# EAGLE schematic MultiEffect (EAGLE 9.6.2)

## Sheet 1 of 2: Audio & Power
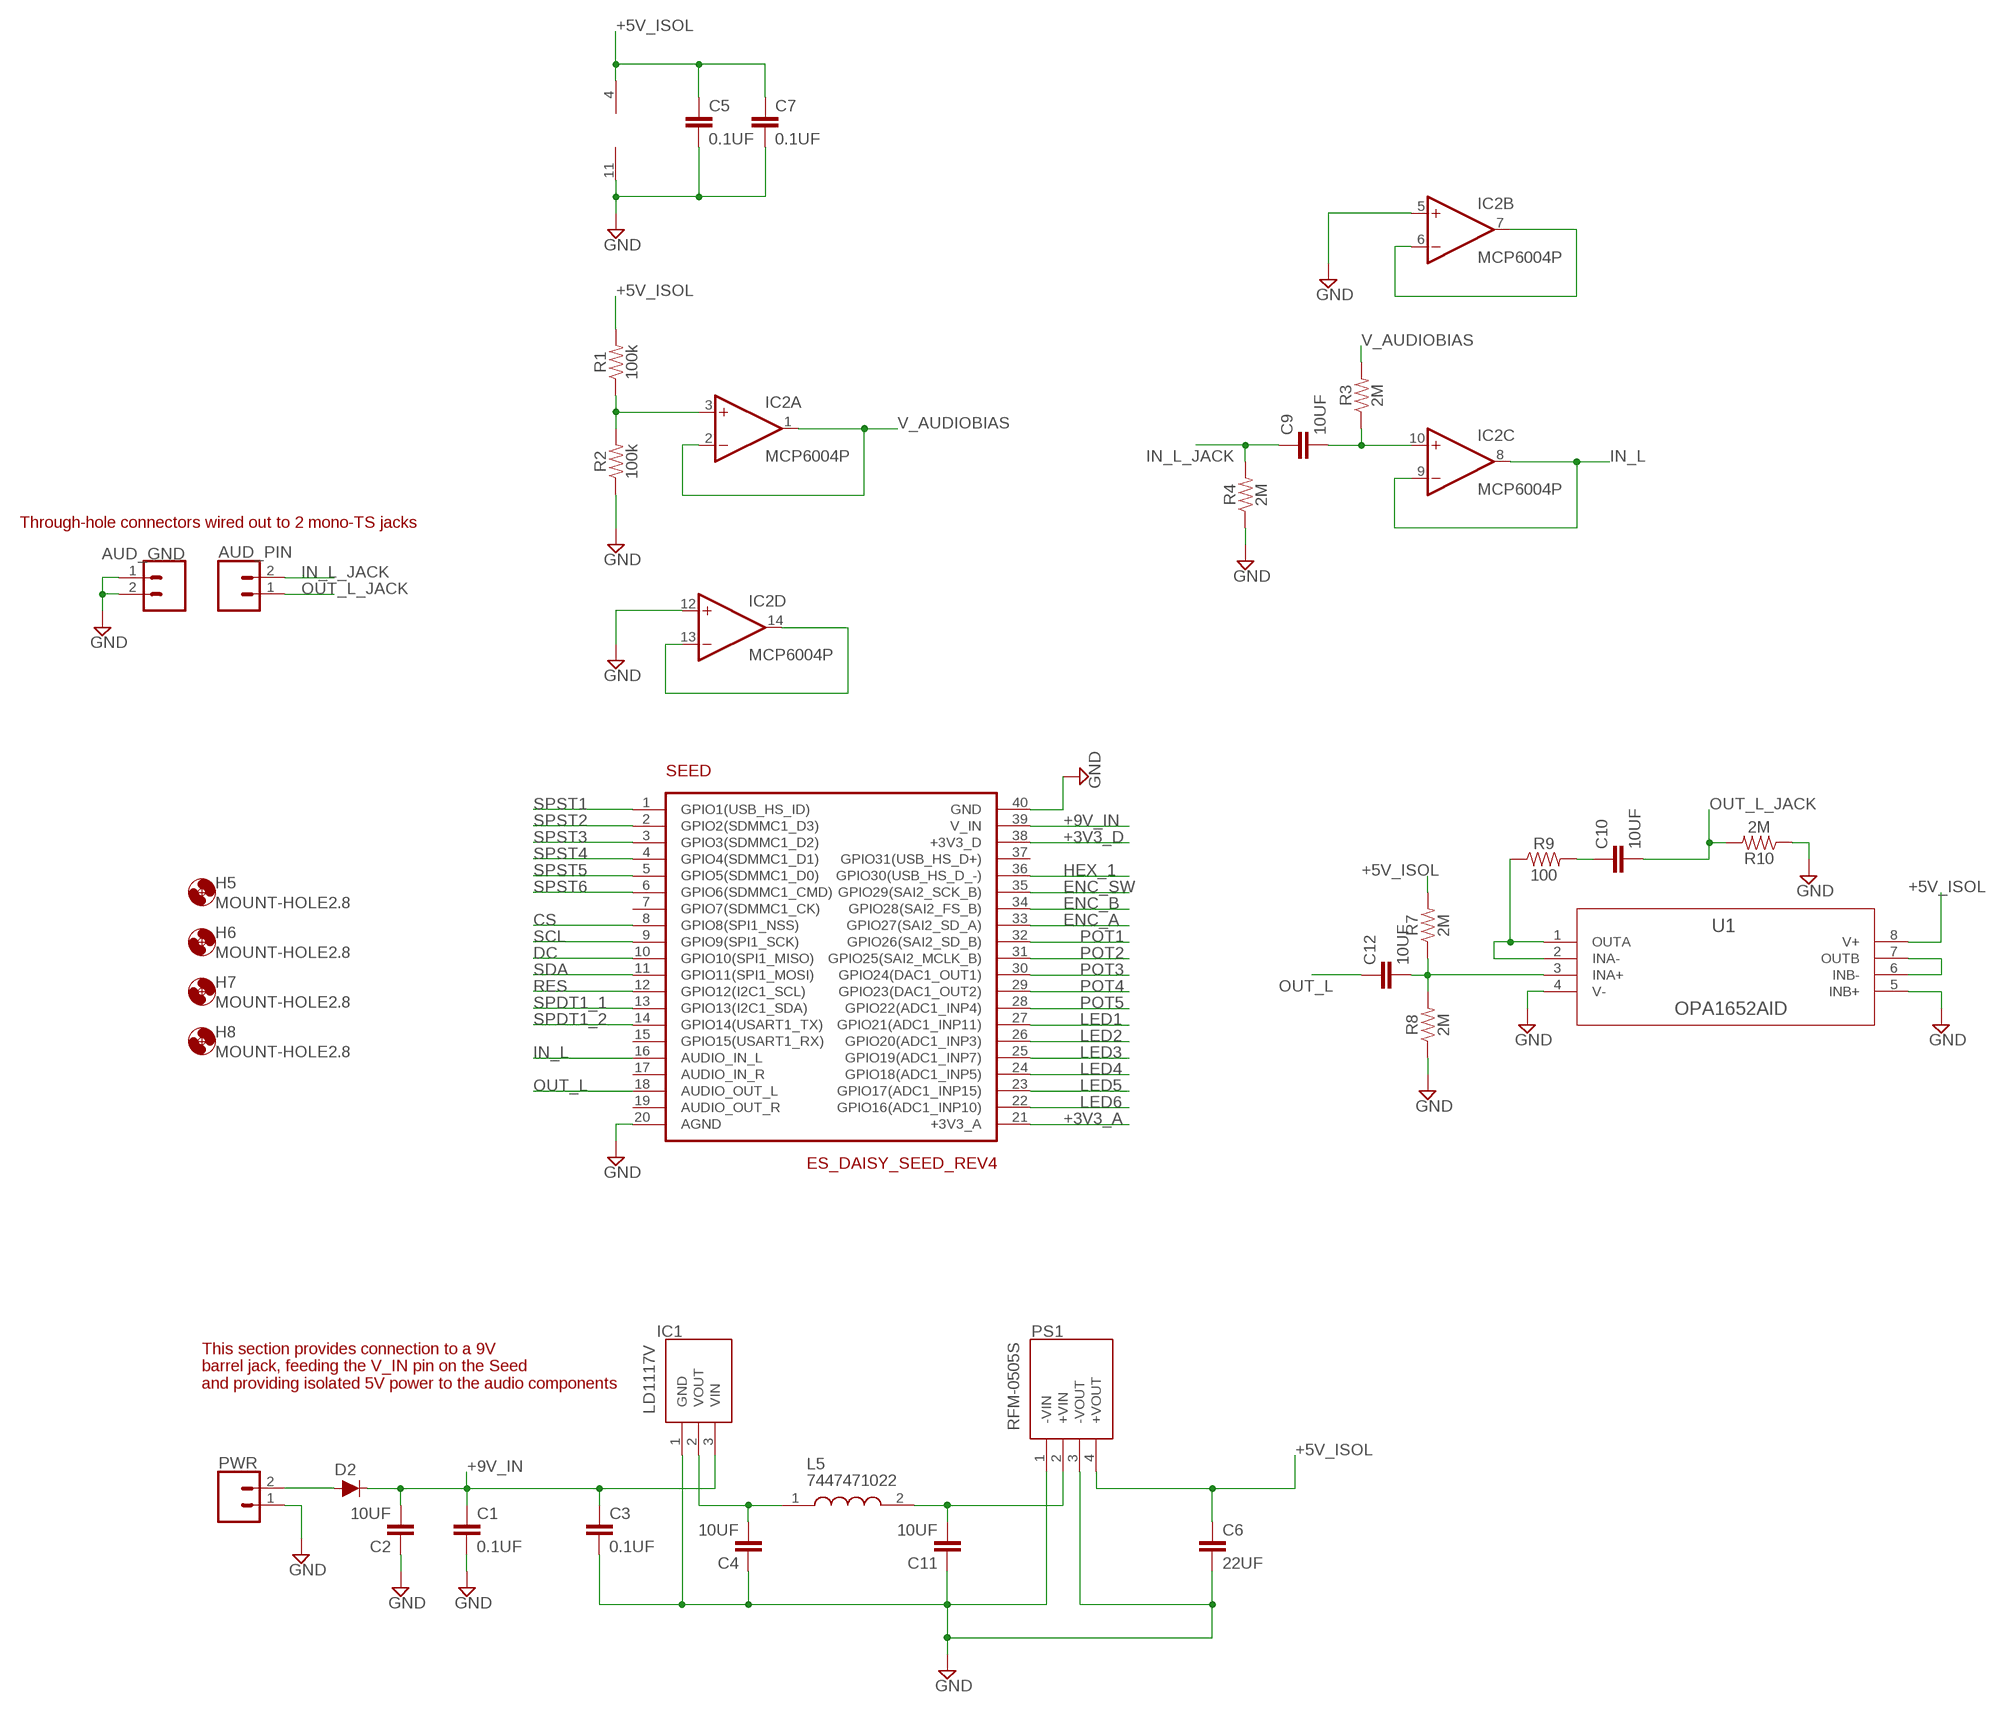
[diagram p0: schematic, sheet 1]

### Parts
AUD_GND  CONN_02  [1X02]
AUD_PIN  CONN_02  [1X02]
C1  0.1UF  [CAP-PTH-SMALL-KIT]
C2  10UF  [CAP-PTH-SMALL-KIT]
C3  0.1UF  [CAP-PTH-SMALL-KIT]
C4  10UF  [CAP-PTH-SMALL-KIT]
C5  0.1UF  [CAP-PTH-SMALL-KIT]
C6  22UF  [CAP-PTH-SMALL-KIT]
C7  0.1UF  [CAP-PTH-SMALL-KIT]
C9  10UF  [CAP-PTH-SMALL-KIT]
C10  10UF  [CAP-PTH-SMALL-KIT]
C11  10UF  [CAP-PTH-SMALL-KIT]
C12  10UF  [CAP-PTH-SMALL-KIT]
D2  200mA/100V/1V  DIODE-1N4148  [DIODE-1N4148]
H5  MOUNT-HOLE2.8  [2,8]
H6  MOUNT-HOLE2.8  [2,8]
H7  MOUNT-HOLE2.8  [2,8]
H8  MOUNT-HOLE2.8  [2,8]
IC1  LD1117V  [TO255P460X1020X2008-3P]
IC2  MCP6004P  [DIL14]
L5  7447471022  [WE-TIS_111190]
PS1  RFM-0505S  [RFM0505S]
PWR  CONN_02  [1X02]
R1  100k  100KOHM-HORIZ-1/4W-5%  [AXIAL-0.3]
R2  100k  100KOHM-HORIZ-1/4W-5%  [AXIAL-0.3]
R3  2M  2MOHM-HORIZ-1/4W-5%  [AXIAL-0.3]
R4  2M  2MOHM-HORIZ-1/4W-5%  [AXIAL-0.3]
R7  2M  2MOHM-HORIZ-1/4W-5%  [AXIAL-0.3]
R8  2M  2MOHM-HORIZ-1/4W-5%  [AXIAL-0.3]
R9  100  100OHM-HORIZ-1/4W-1%  [AXIAL-0.3]
R10  2M  2MOHM-HORIZ-1/4W-5%  [AXIAL-0.3]
SEED  ES_DAISY_SEED_REV4  [ES_DAISY_SEED]
U1  OPA1652AID  [D8]

### Nets
+3V3_A: SEED.21(+3V3_A) ; also sheet 2
+3V3_D: SEED.38(+3V3_D) ; also sheet 2
+5V_ISOL: C5.1 C6.1 C7.1 IC2.4(P:V+) PS1.4(+VOUT) R1.P$2 R7.P$2 U1.8(V+)
+9V_IN: C1.1 C2.2 C3.1 D2.C IC1.3(VIN) SEED.39(V_IN)
CS: SEED.8(GPIO8(SPI1_NSS)) ; also sheet 2
DC: SEED.10(GPIO10(SPI1_MISO)) ; also sheet 2
ENC_A: SEED.33(GPIO27(SAI2_SD_A)) ; also sheet 2
ENC_B: SEED.34(GPIO28(SAI2_FS_B)) ; also sheet 2
ENC_SW: SEED.35(GPIO29(SAI2_SCK_B)) ; also sheet 2
GND: AUD_GND.1 AUD_GND.2 C1.2 C2.1 C3.2 C4.1 C5.2 C6.2 C7.2 C11.1 IC1.1(GND) IC2.5(B:+IN) IC2.11(P:V-) IC2.12(D:+IN) PS1.1(-VIN) PS1.3(-VOUT) PWR.1 R2.P$1 R4.P$1 R8.P$1 R10.P$1 SEED.20(AGND) SEED.40(GND) U1.4(V-) U1.5(INB+) ; also sheet 2
HEX_1: SEED.36(GPIO30(USB_HS_D_-))
IN_L: IC2.8(C:OUT) IC2.9(C:-IN) SEED.16(AUDIO_IN_L)
IN_L_JACK: AUD_PIN.2 C9.1 R4.P$2
LED1: SEED.27(GPIO21(ADC1_INP11)) ; also sheet 2
LED2: SEED.26(GPIO20(ADC1_INP3)) ; also sheet 2
LED3: SEED.25(GPIO19(ADC1_INP7)) ; also sheet 2
LED4: SEED.24(GPIO18(ADC1_INP5)) ; also sheet 2
LED5: SEED.23(GPIO17(ADC1_INP15)) ; also sheet 2
LED6: SEED.22(GPIO16(ADC1_INP10)) ; also sheet 2
N$2: D2.A PWR.2
N$6: IC2.3(A:+IN) R1.P$1 R2.P$2
N$7: C11.2 L5.2 PS1.2(+VIN)
N$8: C4.2 IC1.2(VOUT) L5.1
N$9: C9.2 IC2.10(C:+IN) R3.P$1
N$10: IC2.13(D:-IN) IC2.14(D:OUT)
N$12: C12.2 R7.P$1 R8.P$2 U1.3(INA+)
N$13: R9.P$1 U1.1(OUTA) U1.2(INA-)
N$14: C10.1 R9.P$2
N$15: U1.6(INB-) U1.7(OUTB)
N$18: IC2.6(B:-IN) IC2.7(B:OUT)
OUT_L: C12.1 SEED.18(AUDIO_OUT_L)
OUT_L_JACK: AUD_PIN.1 C10.2 R10.P$2
POT1: SEED.32(GPIO26(SAI2_SD_B)) ; also sheet 2
POT2: SEED.31(GPIO25(SAI2_MCLK_B)) ; also sheet 2
POT3: SEED.30(GPIO24(DAC1_OUT1)) ; also sheet 2
POT4: SEED.29(GPIO23(DAC1_OUT2)) ; also sheet 2
POT5: SEED.28(GPIO22(ADC1_INP4)) ; also sheet 2
RES: SEED.12(GPIO12(I2C1_SCL)) ; also sheet 2
SCL: SEED.9(GPIO9(SPI1_SCK)) ; also sheet 2
SDA: SEED.11(GPIO11(SPI1_MOSI)) ; also sheet 2
SPDT1_1: SEED.13(GPIO13(I2C1_SDA)) ; also sheet 2
SPDT1_2: SEED.14(GPIO14(USART1_TX)) ; also sheet 2
SPST1: SEED.1(GPIO1(USB_HS_ID)) ; also sheet 2
SPST2: SEED.2(GPIO2(SDMMC1_D3)) ; also sheet 2
SPST3: SEED.3(GPIO3(SDMMC1_D2)) ; also sheet 2
SPST4: SEED.4(GPIO4(SDMMC1_D1)) ; also sheet 2
SPST5: SEED.5(GPIO5(SDMMC1_D0)) ; also sheet 2
SPST6: SEED.6(GPIO6(SDMMC1_CMD)) ; also sheet 2
V_AUDIOBIAS: IC2.1(A:OUT) IC2.2(A:-IN) R3.P$2
Unconnected: SEED.7(GPIO7(SDMMC1_CK)) SEED.15(GPIO15(USART1_RX)) SEED.17(AUDIO_IN_R) SEED.19(AUDIO_OUT_R) SEED.37(GPIO31(USB_HS_D+))

### Notes on the sheet
- Through-hole connectors wired out to 2 mono-TS jacks
- This section provides connection to a 9V
  barrel jack, feeding the V_IN pin on the Seed 
  and providing isolated 5V power to the audio components

## Sheet 2 of 2: I/O
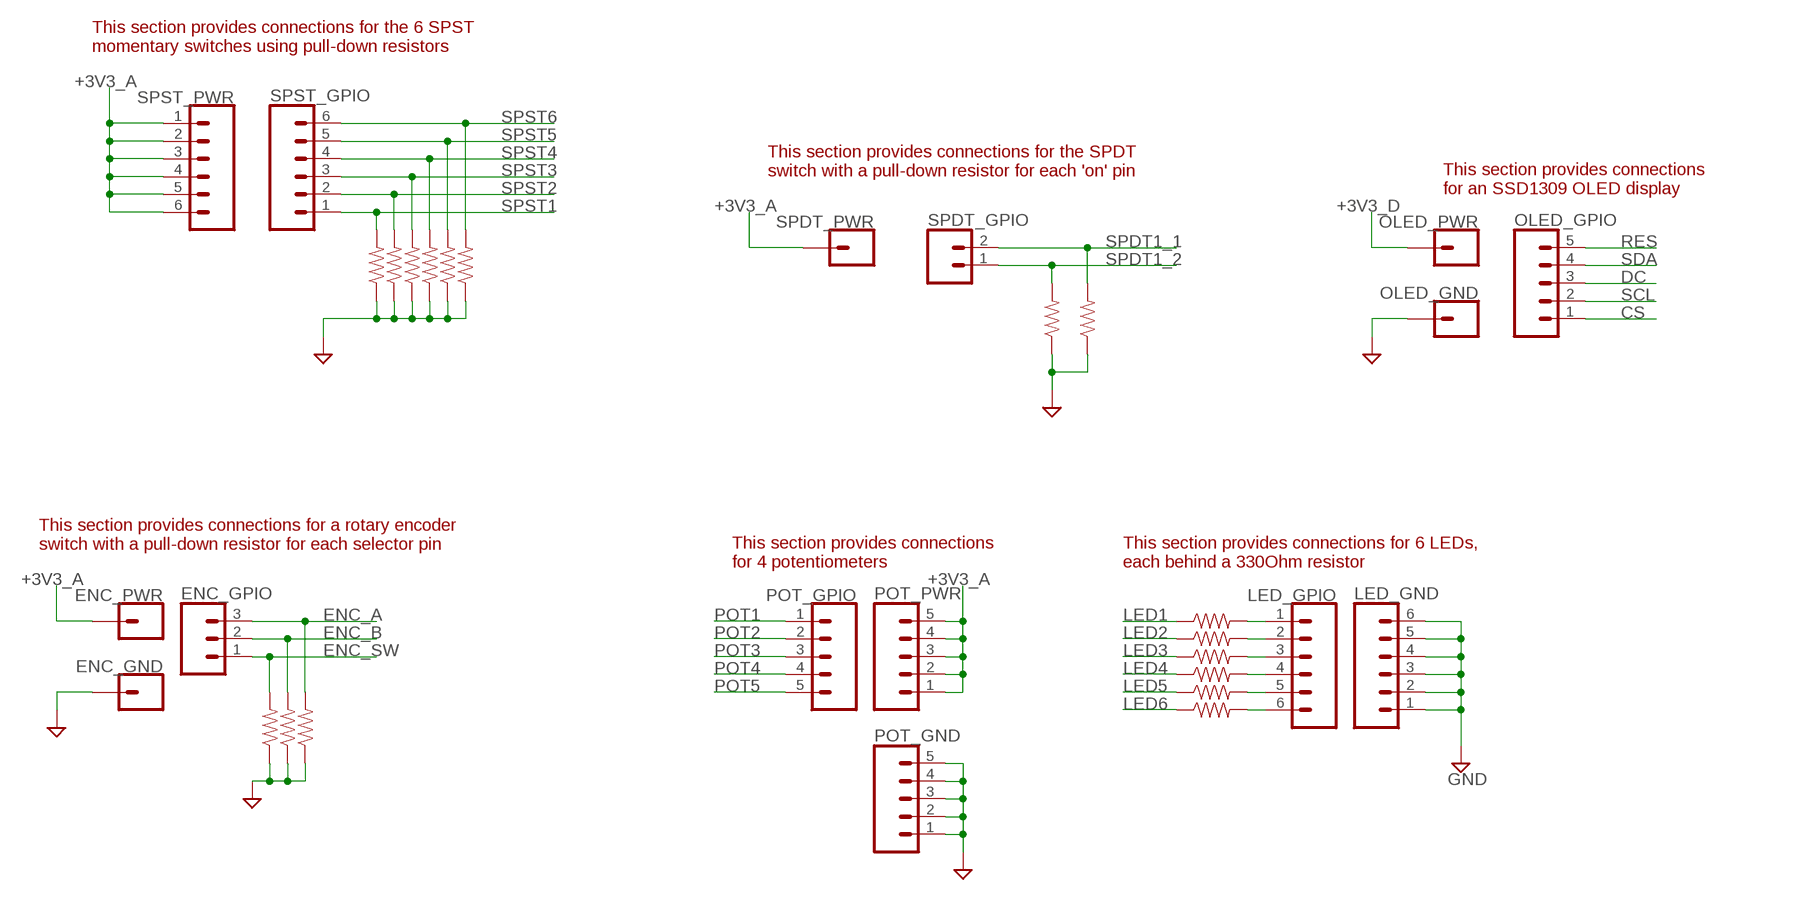
[diagram p1: schematic, sheet 2]

### Parts
D11  10k  10KOHM-HORIZ-1/4W-5%  [AXIAL-0.3]
D12  10k  10KOHM-HORIZ-1/4W-5%  [AXIAL-0.3]
ENC_GND  CONN_01  [1X01]
ENC_GPIO  CONN_03  [1X03]
ENC_PWR  CONN_01  [1X01]
H2  10k  10KOHM-HORIZ-1/4W-5%  [AXIAL-0.3]
H3  10k  10KOHM-HORIZ-1/4W-5%  [AXIAL-0.3]
H4  10k  10KOHM-HORIZ-1/4W-5%  [AXIAL-0.3]
L1  330  330OHM-HORIZ-1/10W-5%  [AXIAL-0.3]
L2  330  330OHM-HORIZ-1/10W-5%  [AXIAL-0.3]
L3  330  330OHM-HORIZ-1/10W-5%  [AXIAL-0.3]
L4  330  330OHM-HORIZ-1/10W-5%  [AXIAL-0.3]
L6  330  330OHM-HORIZ-1/10W-5%  [AXIAL-0.3]
L7  330  330OHM-HORIZ-1/10W-5%  [AXIAL-0.3]
LED_GND  CONN_06SILK_FEMALE_PTH  [1X06]
LED_GPIO  CONN_06SILK_FEMALE_PTH  [1X06]
OLED_GND  CONN_01  [1X01]
OLED_GPIO  CONN_05  [1X05]
OLED_PWR  CONN_01  [1X01]
POT_GND  CONN_05  [1X05]
POT_GPIO  CONN_05  [1X05]
POT_PWR  CONN_05  [1X05]
S1  10k  10KOHM-HORIZ-1/4W-5%  [AXIAL-0.3]
S2  10k  10KOHM-HORIZ-1/4W-5%  [AXIAL-0.3]
S3  10k  10KOHM-HORIZ-1/4W-5%  [AXIAL-0.3]
S4  10k  10KOHM-HORIZ-1/4W-5%  [AXIAL-0.3]
S5  10k  10KOHM-HORIZ-1/4W-5%  [AXIAL-0.3]
S6  10k  10KOHM-HORIZ-1/4W-5%  [AXIAL-0.3]
SPDT_GPIO  CONN_02  [1X02]
SPDT_PWR  CONN_01  [1X01]
SPST_GPIO  CONN_06SILK_FEMALE_PTH  [1X06]
SPST_PWR  CONN_06SILK_FEMALE_PTH  [1X06]

### Nets
+3V3_A: ENC_PWR.1 POT_PWR.1 POT_PWR.2 POT_PWR.3 POT_PWR.4 POT_PWR.5 SPDT_PWR.1 SPST_PWR.1 SPST_PWR.2 SPST_PWR.3 SPST_PWR.4 SPST_PWR.5 SPST_PWR.6 ; also sheet 1
+3V3_D: OLED_PWR.1 ; also sheet 1
CS: OLED_GPIO.1 ; also sheet 1
DC: OLED_GPIO.3 ; also sheet 1
ENC_A: ENC_GPIO.3 H4.P$2 ; also sheet 1
ENC_B: ENC_GPIO.2 H3.P$2 ; also sheet 1
ENC_SW: ENC_GPIO.1 H2.P$2 ; also sheet 1
GND: D11.P$1 D12.P$1 ENC_GND.1 H2.P$1 H3.P$1 H4.P$1 LED_GND.1 LED_GND.2 LED_GND.3 LED_GND.4 LED_GND.5 LED_GND.6 OLED_GND.1 POT_GND.1 POT_GND.2 POT_GND.3 POT_GND.4 POT_GND.5 S1.P$1 S2.P$1 S3.P$1 S4.P$1 S5.P$1 S6.P$1 ; also sheet 1
LED1: L1.P$1 ; also sheet 1
LED2: L2.P$1 ; also sheet 1
LED3: L3.P$1 ; also sheet 1
LED4: L4.P$1 ; also sheet 1
LED5: L6.P$1 ; also sheet 1
LED6: L7.P$1 ; also sheet 1
N$1: L1.P$2 LED_GPIO.1
N$3: L2.P$2 LED_GPIO.2
N$4: L3.P$2 LED_GPIO.3
N$5: L4.P$2 LED_GPIO.4
N$11: L6.P$2 LED_GPIO.5
N$16: L7.P$2 LED_GPIO.6
POT1: POT_GPIO.1 ; also sheet 1
POT2: POT_GPIO.2 ; also sheet 1
POT3: POT_GPIO.3 ; also sheet 1
POT4: POT_GPIO.4 ; also sheet 1
POT5: POT_GPIO.5 ; also sheet 1
RES: OLED_GPIO.5 ; also sheet 1
SCL: OLED_GPIO.2 ; also sheet 1
SDA: OLED_GPIO.4 ; also sheet 1
SPDT1_1: D11.P$2 SPDT_GPIO.2 ; also sheet 1
SPDT1_2: D12.P$2 SPDT_GPIO.1 ; also sheet 1
SPST1: S1.P$2 SPST_GPIO.1 ; also sheet 1
SPST2: S2.P$2 SPST_GPIO.2 ; also sheet 1
SPST3: S3.P$2 SPST_GPIO.3 ; also sheet 1
SPST4: S4.P$2 SPST_GPIO.4 ; also sheet 1
SPST5: S5.P$2 SPST_GPIO.5 ; also sheet 1
SPST6: S6.P$2 SPST_GPIO.6 ; also sheet 1

### Notes on the sheet
- This section provides connections for the 6 SPST 
  momentary switches using pull-down resistors
- This section provides connections for the SPDT 
  switch with a pull-down resistor for each 'on' pin
- This section provides connections 
  for an SSD1309 OLED display
- This section provides connections for a rotary encoder
  switch with a pull-down resistor for each selector pin
- This section provides connections
  for 4 potentiometers
- This section provides connections for 6 LEDs,
  each behind a 330Ohm resistor

## Library data of the parts
AUD_GND AUD_PIN PWR SPDT_GPIO = SparkFun-Connectors:CONN_02: Multi connection point. Often used as Generic Header-pin footprint for 0.1 inch spaced/style header connections On any of the 0.1 inch spaced packages, you can populate with these: Break Away Headers - Straight <https://www.sparkfun.com/products/116> (PRT-00116) Break Away Male Headers - Right Angle <https://www.sparkfun.com/products/553> (PRT-00553) Female Headers <https://www.sparkfun.com/products/115> (PRT-00115) Break Away Headers - Machine Pin <https://www.sparkfun.com/products/117> (PRT-00117) Break Away Female Headers - Swiss Machine Pin <https://www.sparkfun.com/products/743> (PRT-00743) For SCREWTERMINALS and SPRING TERMINALS visit here: Screw Terimnals on SparkFun.com <https://www.sparkfun.com/search/results?term=Screw+Terminals> (5mm/3.5mm/2.54mm spacing) This device is also useful as a general connection point to wire up your design to another part of your project. Our various solder wires solder well into these plated through hole pads. Hook-Up Wire - Assortment (Stranded, 22 AWG) <https://www.sparkfun.com/products/11375> (PRT-11375) Hook-Up Wire - Assortment (Solid Core, 22 AWG) <https://www.sparkfun.com/products/11367> (PRT-11367) View the entire wire category on our website here <https://www.sparkfun.com/categories/141> Special notes: Molex polarized connector foot print use with: PRT-08233 with associated crimp pins and housings. 2.54_SCREWTERM for use with PRT-10571. 3.5mm Screw Terminal footprints for PRT-08084 5mm Screw Terminal footprints for use with PRT-08432
C1 C3 C5 C7 = Custom-Parts:0.1UF
C2 C4 C9-C12 = Custom-Parts:10UF
C6 = Custom-Parts:22UF
D2 = SparkFun-DiscreteSemi:DIODE: Diode These are standard reverse protection diodes and small signal diodes. SparkFun Products: SparkFun SparkPunk Sound Kit <https://www.sparkfun.com/products/11177> SparkFun ESP8266 Thing <https://www.sparkfun.com/products/13231>; PROD_ID: DIO-08378
D11 D12 H2-H4 S1-S6 = SparkFun-Resistors:10KOHM: 10kΩ resistor A resistor is a passive two-terminal electrical component that implements electrical resistance as a circuit element. Resistors act to reduce current flow, and, at the same time, act to lower voltage levels within circuits. - Wikipedia; PROD_ID: RES-09435
ENC_GND ENC_PWR OLED_GND OLED_PWR SPDT_PWR = SparkFun-Connectors:CONN_01: Single connection point. Often used as Generic Header-pin footprint for 0.1 inch spaced/style header connections On any of the 0.1 inch spaced packages, you can populate with these: Break Away Headers - Straight <https://www.sparkfun.com/products/116> (PRT-00116) Break Away Male Headers - Right Angle <https://www.sparkfun.com/products/553> (PRT-00553) Female Headers <https://www.sparkfun.com/products/115> (PRT-00115) Break Away Headers - Machine Pin <https://www.sparkfun.com/products/117> (PRT-00117) Break Away Female Headers - Swiss Machine Pin <https://www.sparkfun.com/products/743> (PRT-00743) This device is also useful as a general connection point to wire up your design to another part of your project. Our various solder wires solder well into these plated through hole pads. Hook-Up Wire - Assortment (Stranded, 22 AWG) <https://www.sparkfun.com/products/11375> (PRT-11375) Hook-Up Wire - Assortment (Solid Core, 22 AWG) <https://www.sparkfun.com/products/11367> (PRT-11367) View the entire wire category on our website here <https://www.sparkfun.com/categories/141> Special notes: SMTSO-256-ET is a "flush mount" nut for a 4-40 screw. We mostly use this on specialty testbeds; it is a nice way to connect hardware to your PCB at an adjustable hieght. Also note, the SNAP packages are for using a snappable style connector. We sell a baggie of snaps and they are also used on two LilyPad designs: Snap Assortment - 30 pack (male and female) <https://www.sparkfun.com/products/11347> (DEV-11347) LilyPad Arduino SimpleSnap <https://www.sparkfun.com/products/10941> (DEV-10941) LilyPad SimpleSnap Protoboard <https://www.sparkfun.com/products/10940> (DEV-10940)
ENC_GPIO = SparkFun-Connectors:CONN_03: Multi connection point. Often used as Generic Header-pin footprint for 0.1 inch spaced/style header connections On any of the 0.1 inch spaced packages, you can populate with these: Break Away Headers - Straight <https://www.sparkfun.com/products/116> (PRT-00116) Break Away Male Headers - Right Angle <https://www.sparkfun.com/products/553> (PRT-00553) Female Headers <https://www.sparkfun.com/products/115> (PRT-00115) Break Away Headers - Machine Pin <https://www.sparkfun.com/products/117> (PRT-00117) Break Away Female Headers - Swiss Machine Pin <https://www.sparkfun.com/products/743> (PRT-00743) Stackable Header - 3 Pin (Female, 0.1") <https://www.sparkfun.com/products/13875> (PRT-13875) For SCREWTERMINALS and SPRING TERMINALS visit here: Screw Terimnals on SparkFun.com <https://www.sparkfun.com/search/results?term=Screw+Terminals> (5mm/3.5mm/2.54mm spacing) This device is also useful as a general connection point to wire up your design to another part of your project. Our various solder wires solder well into these plated through hole pads. Hook-Up Wire - Assortment (Stranded, 22 AWG) <https://www.sparkfun.com/products/11375> (PRT-11375) Hook-Up Wire - Assortment (Solid Core, 22 AWG) <https://www.sparkfun.com/products/11367> (PRT-11367) View the entire wire category on our website here <https://www.sparkfun.com/categories/141> Special notes: Molex polarized connector foot print use with SKU : PRT-08232 with associated crimp pins and housings.
H5-H8 = holes:MOUNT-HOLE: MOUNTING HOLE with drill center marker
IC1 = SamacSys_Parts:LD1117V: I.C. LD1117V Source: Datasheet <https://www.mouser.com/datasheet/2/389/ld1117-974075.pdf>; ARROW_PART_NUMBER: LD1117V; ARROW_PRICE-STOCK: https://www.arrow.com/en/products/ld1117v/stmicroelectronics; DESCRIPTION: I.C. LD1117V; HEIGHT: 4.6mm; MANUFACTURER_NAME: STMicroelectronics; MANUFACTURER_PART_NUMBER: LD1117V; MOUSER_PART_NUMBER: 511-LD1117V; MOUSER_PRICE-STOCK: https://www.mouser.co.uk/ProductDetail/STMicroelectronics/LD1117V?qs=tZUCD5p2VWqhC74a4KMNzA%3D%3D
IC2 = Custom-Parts:MCP6004: Quad Op Amp 2.7V to 6.0V Single Supply CMOS Source: https://www.mouser.com/datasheet/2/268/21733e-41017.pdf
L1-L4 L6 L7 = SparkFun-Resistors:330OHM: 330Ω resistor A resistor is a passive two-terminal electrical component that implements electrical resistance as a circuit element. Resistors act to reduce current flow, and, at the same time, act to lower voltage levels within circuits. - Wikipedia; PROD_ID: RES-8371
L5 = SamacSys_Parts:7447471022: Wurth 2.2 uH +/-20% Ferrite Leaded Inductor, Max SRF:75MHz, 10A Idc, 0.009 Rdc WE-TIS Source: Datasheet <https://componentsearchengine.com/Datasheets/1/7447471022.pdf>; DESCRIPTION: Wurth 2.2 uH +/-20% Ferrite Leaded Inductor, Max SRF:75MHz, 10A Idc, 0.009 Rdc WE-TIS; HEIGHT: mm; MANUFACTURER_NAME: Wurth Elektronik; MANUFACTURER_PART_NUMBER: 7447471022; MOUSER_PART_NUMBER: 710-7447471022; MOUSER_PRICE-STOCK: https://www.mouser.com/Search/Refine.aspx?Keyword=710-7447471022
LED_GND LED_GPIO SPST_GPIO SPST_PWR = SparkFun-Connectors:CONN_06: Multi connection point. Often used as Generic Header-pin footprint for 0.1 inch spaced/style header connections On any of the 0.1 inch spaced packages, you can populate with these: Break Away Headers - Straight <https://www.sparkfun.com/products/116> (PRT-00116) Break Away Male Headers - Right Angle <https://www.sparkfun.com/products/553> (PRT-00553) Female Headers <https://www.sparkfun.com/products/115> (PRT-00115) Break Away Headers - Machine Pin <https://www.sparkfun.com/products/117> (PRT-00117) Break Away Female Headers - Swiss Machine Pin <https://www.sparkfun.com/products/743> (PRT-00743) Arduino Stackable Header - 6 Pin <https://www.sparkfun.com/products/9280> (PRT-09280) For SCREWTERMINALS and SPRING TERMINALS visit here: Screw Terimnals on SparkFun.com <https://www.sparkfun.com/search/results?term=Screw+Terminals> (5mm/3.5mm/2.54mm spacing) This device is also useful as a general connection point to wire up your design to another part of your project. Our various solder wires solder well into these plated through hole pads. Hook-Up Wire - Assortment (Stranded, 22 AWG) <https://www.sparkfun.com/products/11375> (PRT-11375) Hook-Up Wire - Assortment (Solid Core, 22 AWG) <https://www.sparkfun.com/products/11367> (PRT-11367) View the entire wire category on our website here <https://www.sparkfun.com/categories/141>; PROD_ID: CONN-08437
OLED_GPIO POT_GND POT_GPIO POT_PWR = SparkFun-Connectors:CONN_05: Multi connection point. Often used as Generic Header-pin footprint for 0.1 inch spaced/style header connections On any of the 0.1 inch spaced packages, you can populate with these: Break Away Headers - Straight <https://www.sparkfun.com/products/116> (PRT-00116) Break Away Male Headers - Right Angle <https://www.sparkfun.com/products/553> (PRT-00553) Female Headers <https://www.sparkfun.com/products/115> (PRT-00115) Break Away Headers - Machine Pin <https://www.sparkfun.com/products/117> (PRT-00117) Break Away Female Headers - Swiss Machine Pin <https://www.sparkfun.com/products/743> (PRT-00743) For SCREWTERMINALS and SPRING TERMINALS visit here: Screw Terimnals on SparkFun.com <https://www.sparkfun.com/search/results?term=Screw+Terminals> (5mm/3.5mm/2.54mm spacing) This device is also useful as a general connection point to wire up your design to another part of your project. Our various solder wires solder well into these plated through hole pads. Hook-Up Wire - Assortment (Stranded, 22 AWG) <https://www.sparkfun.com/products/11375> (PRT-11375) Hook-Up Wire - Assortment (Solid Core, 22 AWG) <https://www.sparkfun.com/products/11367> (PRT-11367) View the entire wire category on our website here <https://www.sparkfun.com/categories/141> Special notes: Molex polarized connector foot print use with SKU : PRT-08231 with associated crimp pins and housings. 1MM SMD Version SKU: PRT-10208
PS1 = SamacSys_Parts:RFM-0505S: RECOM POWER - RFM-0505S - DC-DC CONVERTER, 5V, 0.2A Source: Datasheet <https://www.recom-power.com/pdf/Econoline/RFM.pdf>; DESCRIPTION: RECOM POWER - RFM-0505S - DC-DC CONVERTER, 5V, 0.2A; HEIGHT: 10.5mm; MANUFACTURER_NAME: RECOM Power; MANUFACTURER_PART_NUMBER: RFM-0505S; MOUSER_PART_NUMBER: 919-RFM-0505S; MOUSER_PRICE-STOCK: https://www.mouser.co.uk/ProductDetail/RECOM-Power/RFM-0505S?qs=lYGu3FyN48dRVYKTH5ipqg%3D%3D
R1 R2 = SparkFun-Resistors:100KOHM: 100kΩ resistor A resistor is a passive two-terminal electrical component that implements electrical resistance as a circuit element. Resistors act to reduce current flow, and, at the same time, act to lower voltage levels within circuits. - Wikipedia; PROD_ID: RES-10686
R3 R4 R7 R8 R10 = Custom-Parts:2MOHM: 2MΩ resistor A resistor is a passive two-terminal electrical component that implements electrical resistance as a circuit element. Resistors act to reduce current flow, and, at the same time, act to lower voltage levels within circuits. - Wikipedia; PROD_ID: RES-09329
R9 = SparkFun-Resistors:100OHM: 100Ω resistor A resistor is a passive two-terminal electrical component that implements electrical resistance as a circuit element. Resistors act to reduce current flow, and, at the same time, act to lower voltage levels within circuits. - Wikipedia; PROD_ID: RES-12181
SEED = Electrosmith-Boards:ES_DAISY_SEED_REV4; IPN: Daisy Seed
U1 = Custom-Parts:OPA1652AID; DATASHEET_URL: http://www.ti.com/lit/gpn/OPA1652; DESCRIPTION: Sound Plus Low Noise and Distortion, General-Purpose, FET-Input Audio Op Amps; FAMILY_NAME: LOW NOISE; GENERIC_PART_NUMBER: OPA1652; INDUSTRY_STD_PKG_TYPE: SOIC; MANUFACTURER: Texas Instruments; MANUFACTURER_PART_NUMBER: OPA1652AID; PACKAGE_DESIGNATOR: D; PIN_COUNT: 8; VENDOR: Texas Instruments

## Net classes
0 DEFAULT: width 0.102 mm, drill 0.2 mm, clearance 0.102 mm